# EAGLE design Mirtle_Teensy3_ESP_2016_Hotec6c (EAGLE 7.6.0)
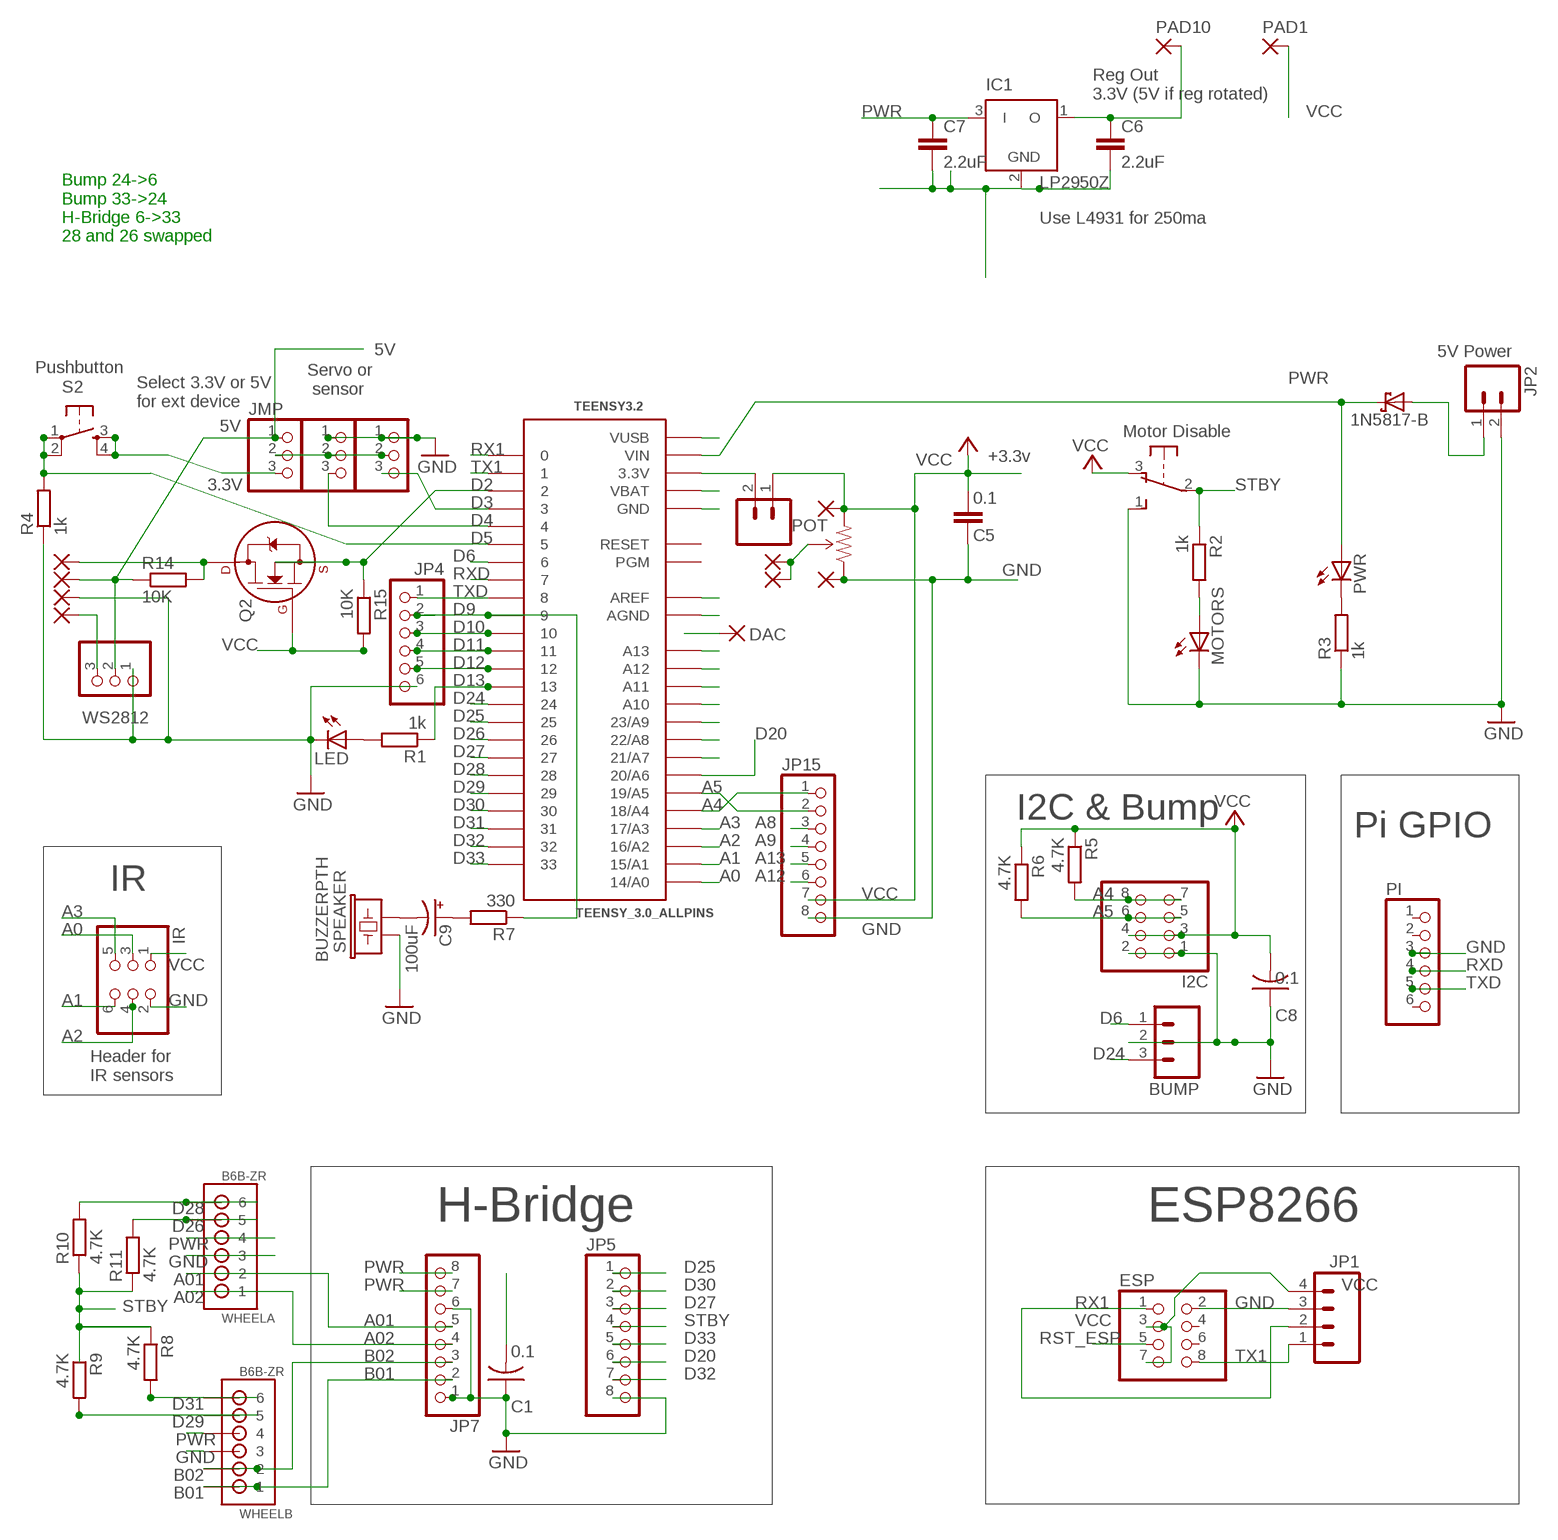
[diagram p0: schematic, sheet 1]

## Parts
3V3  M02PTH  [1X02]
BUMP  M03SCREW  [SCREWTERMINAL-3.5MM-3]
C1  0.1  C-US025-024X044  [C025-024X044]
C5  0.1  CAPEZ  [CAP-PTH-SMALLEZ]
C6  2.2uF  C-EU050-024X044  [C050-024X044]
C7  2.2uF  C-EU050-024X044  [C050-024X044]
C8  0.1  C-US025-024X044  [C025-024X044]
C9  100uF  CPOL-USE2.5-5  [E2,5-5]
D1  1N5817-B  [DO41-7.6]
DAC  1,6/0,8  [1,6/0,8]
ESP  PINHD-2X4  [2X04]
EXT  PINHD-1X3  [1X03]
EXT1  PINHD-1X3  [1X03]
I2C  PINHD-2X4  [2X04]
IC1  LP2950Z  [TO92]
IR  PINHD-2X3  [2X03]
JMP  PINHD-1X3  [1X03]
JP1  M04PTH  [1X04]
JP2  M023.5MM  [SCREWTERMINAL-3.5MM-2]
JP4  PINHD-1X6B  [1X06-BIG]
JP5  PINHD-1X8CLEANBIG  [1X08-CLEANBIG]
JP7  PINHD-1X8CLEANBIG  [1X08-CLEANBIG]
JP15  PINHD-1X8BIG  [1X08-BIG]
LED  LED3MM  [LED3MM]
MOTORS  LED3MM  [LED3MM]
PAD1  1,6/0,8  [1,6/0,8]
PAD2  1,6/0,8  [1,6/0,8]
PAD3  1,6/0,8  [1,6/0,8]
PAD4  1,6/0,8  [1,6/0,8]
PAD5  1,6/0,8  [1,6/0,8]
PAD6  1,6/0,8  [1,6/0,8]
PAD7  1,6/0,8  [1,6/0,8]
PAD8  1,6/0,8  [1,6/0,8]
PAD9  1,6/0,8  [1,6/0,8]
PAD10  1,6/0,8  [1,6/0,8]
PI  PINHD-1X6  [1X06]
POT  TSR-3386  TRIMPOT-PTH-KNOB  [3386U]
PWR  LED3MM  [LED3MM]
Q2  2N7000_TO92  [TO-92]
R1  1k  R-EU_0204/7  [0204/7]
R2  1k  R-EU_0204/7  [0204/7]
R3  1k  R-EU_0204/7  [0204/7]
R4  1k  R-EU_0204/7  [0204/7]
R5  4.7K  R-EU_0204/7  [0204/7]
R6  4.7K  R-EU_0204/7  [0204/7]
R7  330  R-EU_0204/7  [0204/7]
R8  4.7K  R-EU_0204/5  [0204/5]
R9  4.7K  R-EU_0204/5  [0204/5]
R10  4.7K  R-EU_0204/5  [0204/5]
R11  4.7K  R-EU_0204/5  [0204/5]
R14  10K  R-EU_0204/5  [0204/5]
R15  10K  R-EU_0204/5  [0204/5]
S2  TAC_SWITCHPTH  [TACTILE-PTH]
SPEAKER  BUZZERPTH  [BUZZER-12MM]
SW1  OS102011MA1Q  [OS102011MA1Q]
TEENSY3.2  TEENSY_3.0_ALLPINS  [TEENSY_3.0_ALLPINS]
WHEELA  B6B-ZR  [B6B-ZR]
WHEELB  B6B-ZR  [B6B-ZR]
WS2812  PINHD-1X3  [1X03]

## Nets
2N700: PAD2.1(P) Q2.3(D) R14.2
5VIN: C1.2 D1.A JP2.1
A0: IR.3 TEENSY3.2.14/A0
A1: IR.6 TEENSY3.2.15/A1
A01: JP7.5 WHEELA.2
A2: IR.4 TEENSY3.2.16/A2
A02: JP7.4 WHEELA.1
A3: IR.5 TEENSY3.2.17/A3
A4: I2C.7 I2C.8 JP15.1 R5.2 TEENSY3.2.18/A4
A5: I2C.5 I2C.6 JP15.2 R6.2 TEENSY3.2.19/A5
A7: PAD6.1(P) PAD9.1(P) POT.2(WIPER) TEENSY3.2.21/A7
A8: JP15.3 TEENSY3.2.22/A8
A9: JP15.4 TEENSY3.2.23/A9
A10: TEENSY3.2.A10
A11: TEENSY3.2.A11
A12: JP15.6 TEENSY3.2.A12
A13: JP15.5 TEENSY3.2.A13
B01: JP7.2 WHEELB.1
B02: JP7.3 WHEELB.2
D2: Q2.1(S) R15.1 TEENSY3.2.2
D3: EXT.3 TEENSY3.2.3
D4: EXT1.3 TEENSY3.2.4
D5: R4.2 S2.1 S2.2 TEENSY3.2.5
D6: BUMP.1 TEENSY3.2.6
D9: JP4.2 R7.1 TEENSY3.2.9
D10: JP4.3 TEENSY3.2.10
D11: JP4.4 TEENSY3.2.11
D12: JP4.5 TEENSY3.2.12
D13: R1.1 TEENSY3.2.13
D20: JP5.6 TEENSY3.2.20/A6
D24: BUMP.3 TEENSY3.2.24
D25: JP5.1 TEENSY3.2.25
D26: R11.2 TEENSY3.2.26 WHEELA.5
D27: JP5.3 TEENSY3.2.27
D28: R10.2 TEENSY3.2.28 WHEELA.6
D29: R9.2 TEENSY3.2.29 WHEELB.5
D30: JP5.2 TEENSY3.2.30
D31: R8.2 TEENSY3.2.31 WHEELB.6
D32: JP5.7 TEENSY3.2.32
D33: JP5.5 TEENSY3.2.33
GND: BUMP.2 C1.1 C5.1 C6.2 C7.2 C8.1 ESP.2 EXT1.1 EXT.1 I2C.1 I2C.2 IC1.2(GND) IR.2 JP1.3 JP2.2 JP4.6 JP5.8 JP7.1 JP7.6 JP15.8 LED.K(C) MOTORS.K(C) PAD4.1(P) PAD8.1(P) PI.3 POT.1(CCW) R3.1 R4.1 SPEAKER.+ SW1.1(S) TEENSY3.2.AGND TEENSY3.2.GND TEENSY3.2.GND1(GND) TEENSY3.2.GND2(GND) WHEELA.3 WHEELB.3 WS2812.1
N$2: TEENSY3.2.VUSB
N$3: PWR.K(C) R3.2
N$4: LED.A R1.2
N$5: TEENSY3.2.VBAT
N$6: TEENSY3.2.AREF
N$7: 3V3.2 TEENSY3.2.3.3V TEENSY3.2.3.3V1(3.3V) TEENSY3.2.3.3V2(3.3V)
N$8: MOTORS.A R2.2
N$9: C6.1 IC1.1(O) PAD10.1(P)
N$12: PAD5.1(P) WS2812.3
N$13: EXT1.2 EXT.2 JMP.2
N$15: C9.- SPEAKER.-
N$16: C9.+ R7.2
N$51: DAC.1(P)
PWR: C7.1 D1.C IC1.3(I) JMP.1 JP7.7 JP7.8 PAD3.1(P) PWR.A R14.1 TEENSY3.2.VIN WHEELA.4 WHEELB.4 WS2812.2
RST_ESP: ESP.5
RX1: ESP.1 JP1.2 TEENSY3.2.0
RXD: PI.4 TEENSY3.2.7
STBY: JP5.4 R2.1 R8.1 R9.1 R10.1 R11.1 SW1.2(P)
TX1: ESP.8 JP1.1 TEENSY3.2.1
TXD: JP4.1 PI.5 TEENSY3.2.8
VCC: 3V3.1 C5.2 C8.2 ESP.3 ESP.7 I2C.3 I2C.4 IR.1 JMP.3 JP1.4 JP15.7 PAD1.1(P) PAD7.1(P) POT.3(CW) Q2.2(G) R5.1 R6.1 R15.2 S2.3 S2.4 SW1.3(O)
Unconnected: ESP.4 ESP.6 PI.1 PI.2 PI.6 SW1.MT1(MT) SW1.MT2(MT) TEENSY3.2.PGM TEENSY3.2.RESET

## Notes on the sheet
- Reg Out
  3.3V (5V if reg rotated)
- Use L4931 for 250ma
- Bump 24->6
  Bump 33->24
  H-Bridge 6->33
  28 and 26 swapped
- 5V | 5V Power
- Pushbutton
- Servo or
   sensor
- Select 3.3V or 5V
  for ext device
- 5V
- Motor Disable
- +3.3v
- 3.3V
- I2C & Bump
- Pi GPIO
- IR
- Header for
  IR sensors
- H-Bridge | ESP8266

## Library data of the parts
3V3 JP2 = SparkFun-Connectors:M02: Standard 2-pin 0.1" header. Use with - straight break away headers ( PRT-00116) - right angle break away headers (PRT-00553) - swiss pins (PRT-00743) - machine pins (PRT-00117) - female headers (PRT-00115) Molex polarized connector foot print use with: PRT-08233 with associated crimp pins and housings. 2.54_SCREWTERM for use with PRT-10571. 3.5mm Screw Terminal footprints for PRT-08084 5mm Screw Terminal footprints for use with PRT-08433
BUMP = SparkFun-Connectors:M03: Header 3 Standard 3-pin 0.1" header. Use with straight break away headers (SKU : PRT-00116), right angle break away headers (PRT-00553), swiss pins (PRT-00743), machine pins (PRT-00117), and female headers (PRT-00115). Molex polarized connector foot print use with SKU : PRT-08232 with associated crimp pins and housings.
C1 C8 = adafruit_mem:C-US: CAPACITOR, American symbol
C5 = SparkFun-Passives:CAP: Capacitor Standard 0603 ceramic capacitor, and 0.1" leaded capacitor.
C6 C7 = rcl:C-EU: CAPACITOR, European symbol
C9 = adafruit:CPOL-US: POLARIZED CAPACITOR, American symbol
D1 = diode:1N581*: 1.0A SCHOTTKY BARRIER RECTIFIER Source: http://www.diodes.com/datasheets/ds23001.pdf
DAC PAD1-PAD10 = wirepad:1,6/0,8: THROUGH-HOLE PAD
ESP = adafruit_mem:PINHD-2X4: PIN HEADER
EXT EXT1 JMP WS2812 = adafruit:PINHD-1X3: PIN HEADER
I2C = adafruit:PINHD-2X4: PIN HEADER
IC1 = linear:LP2950: 100 mA, Low Power Low Dropout Voltage Regulator Source: http://www.onsemi.com/pub/Collateral/LP2950-D.PDF
IR = pinhead:PINHD-2X3: PIN HEADER
JP1 = SparkFun-Connectors:M04: Header 4 Standard 4-pin 0.1" header. Use with straight break away headers (SKU : PRT-00116), right angle break away headers (PRT-00553), swiss pins (PRT-00743), machine pins (PRT-00117), and female headers (PRT-00115). Molex polarized connector foot print use with SKU : PRT-08231 with associated crimp pins and housings. 1MM SMD Version SKU: PRT-10208
JP4 PI = adafruit:PINHD-1X6: PIN HEADER
JP5 JP7 JP15 = adafruit:PINHD-1X8: PIN HEADER
LED MOTORS PWR = led:LED: LED OSRAM: - CHIPLED LG R971, LG N971, LY N971, LG Q971, LY Q971, LO R971, LY R971 LH N974, LH R974 LS Q976, LO Q976, LY Q976 LO Q996 - Hyper CHIPLED LW Q18S LB Q993, LB Q99A, LB R99A - SideLED LS A670, LO A670, LY A670, LG A670, LP A670 LB A673, LV A673, LT A673, LW A673 LH A674 LY A675 LS A676, LA A676, LO A676, LY A676, LW A676 LS A679, LY A679, LG A679 - Hyper Micro SIDELED® LS Y876, LA Y876, LO Y876, LY Y876 LT Y87S - SmartLED LW L88C, LW L88S LB L89C, LB L89S, LG L890 LS L89K, LO L89K, LY L89K LS L896, LA L896, LO L896, LY L896 - TOPLED LS T670, LO T670, LY T670, LG T670, LP T670 LSG T670, LSP T670, LSY T670, LOP T670, LYG T670 LG T671, LOG T671, LSG T671 LB T673, LV T673, LT T673, LW T673 LH T674 LS T676, LA T676, LO T676, LY T676, LB T676, LH T676, LSB T676, LW T676 LB T67C, LV T67C, LT T67C, LS T67K, LO T67K, LY T67K, LW E67C LS E67B, LA E67B, LO E67B, LY E67B, LB E67C, LV E67C, LT E67C LW T67C LS T679, LY T679, LG T679 LS T770, LO T770, LY T770, LG T770, LP T770 LB T773, LV T773, LT T773, LW T773 LH T774 LS E675, LA E675, LY E675, LS T675 LS T776, LA T776, LO T776, LY T776, LB T776 LHGB T686 LT T68C, LB T68C - Hyper Mini TOPLED® LB M676 - Mini TOPLED Santana® LG M470 LS M47K, LO M47K, LY M47K Source: http://www.osram.convergy.de LUXEON: - LUMILED® LXK2-PW12-R00, LXK2-PW12-S00, LXK2-PW14-U00, LXK2-PW14-V00 LXK2-PM12-R00, LXK2-PM12-S00, LXK2-PM14-U00 LXK2-PE12-Q00, LXK2-PE12-R00, LXK2-PE12-S00, LXK2-PE14-T00, LXK2-PE14-U00 LXK2-PB12-K00, LXK2-PB12-L00, LXK2-PB12-M00, LXK2-PB14-N00, LXK2-PB14-P00, LXK2-PB14-Q00 LXK2-PR12-L00, LXK2-PR12-M00, LXK2-PR14-Q00, LXK2-PR14-R00 LXK2-PD12-Q00, LXK2-PD12-R00, LXK2-PD12-S00 LXK2-PH12-R00, LXK2-PH12-S00 LXK2-PL12-P00, LXK2-PL12-Q00, LXK2-PL12-R00 Source: www.luxeon.com KINGBRIGHT: KA-3528ASYC Source: www.kingbright.com
POT = SparkFun-Electromechanical:TRIMPOT: Various small potentiometers for "set-and-forget" applications; PROD_ID: RES-09730
Q2 = transistors:2N700*: 2N7000, 2N7002, NDS7002A N-channel enhancement mode MOSFET
R1-R11 R14 R15 = resistor:R-EU_: RESISTOR, European symbol
S2 = SparkFun-Electromechanical:TAC_SWITCH: Momentary Switch Button commonly used for reset or general input. Spark Fun Electronics SKU : COM-00097 SMT- SWCH-08247
SPEAKER = SparkFun-Electromechanical:BUZZER: Buzzer 12mm Spark Fun Electronics SKU : Comp-Buzzer
SW1 = adafruit_mem:OS102011MA1Q: OS10201MA1Q through-hole right angle switch http://www.ladyada.net/library/eagle
TEENSY3.2 = Teensy3.0:TEENSY_3.0_ALLPINS: Teensy 3.0 with all pin holes and optional SMD-mount unshrouded header on bottom of Teensy 3.0. For more basic versions, see 'Basic', '+4' and 'AllAnalogPins'. Requires the installation of a un-shrouded SMD header on the underside of the Teensy 3.0
WHEELA WHEELB = jst:B6B-ZR: JST-ZH Connector 6 pol, 1.5mm pitch Package: B6B-ZR Source: http://www.jst-mfg.com/product/pdf/eng/eZH.pdf

## Net classes
1 power: width 0.305 mm, clearance 0.305 mm

## Board
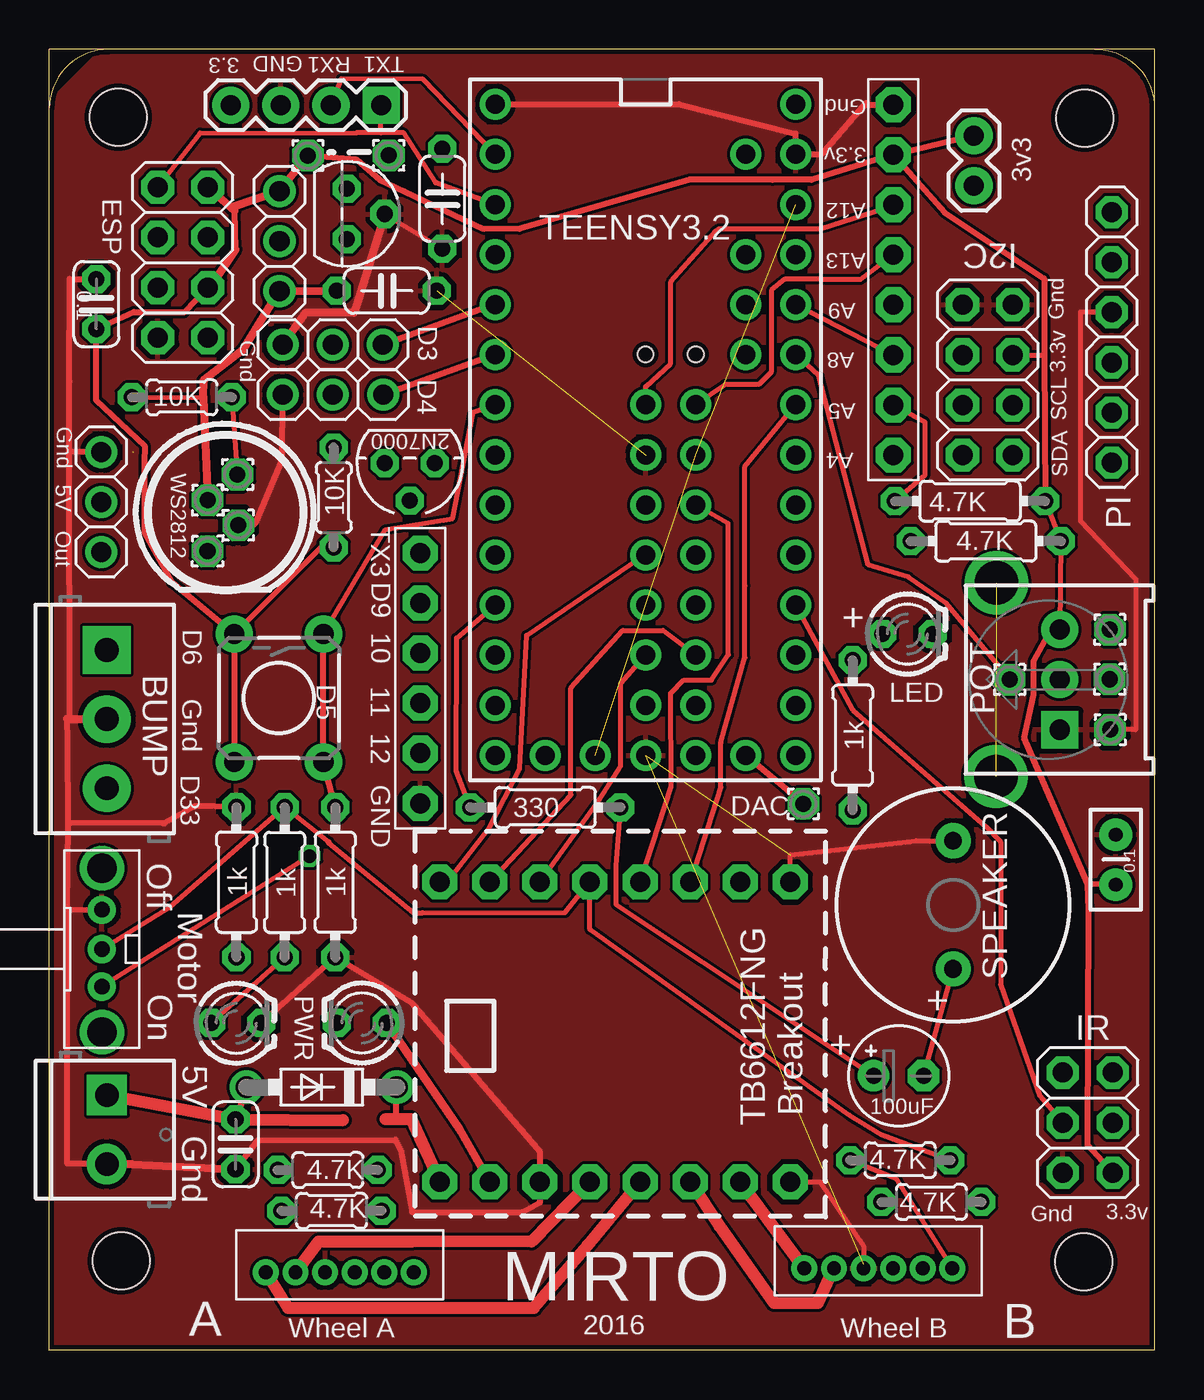
[diagram p1: board, top side]
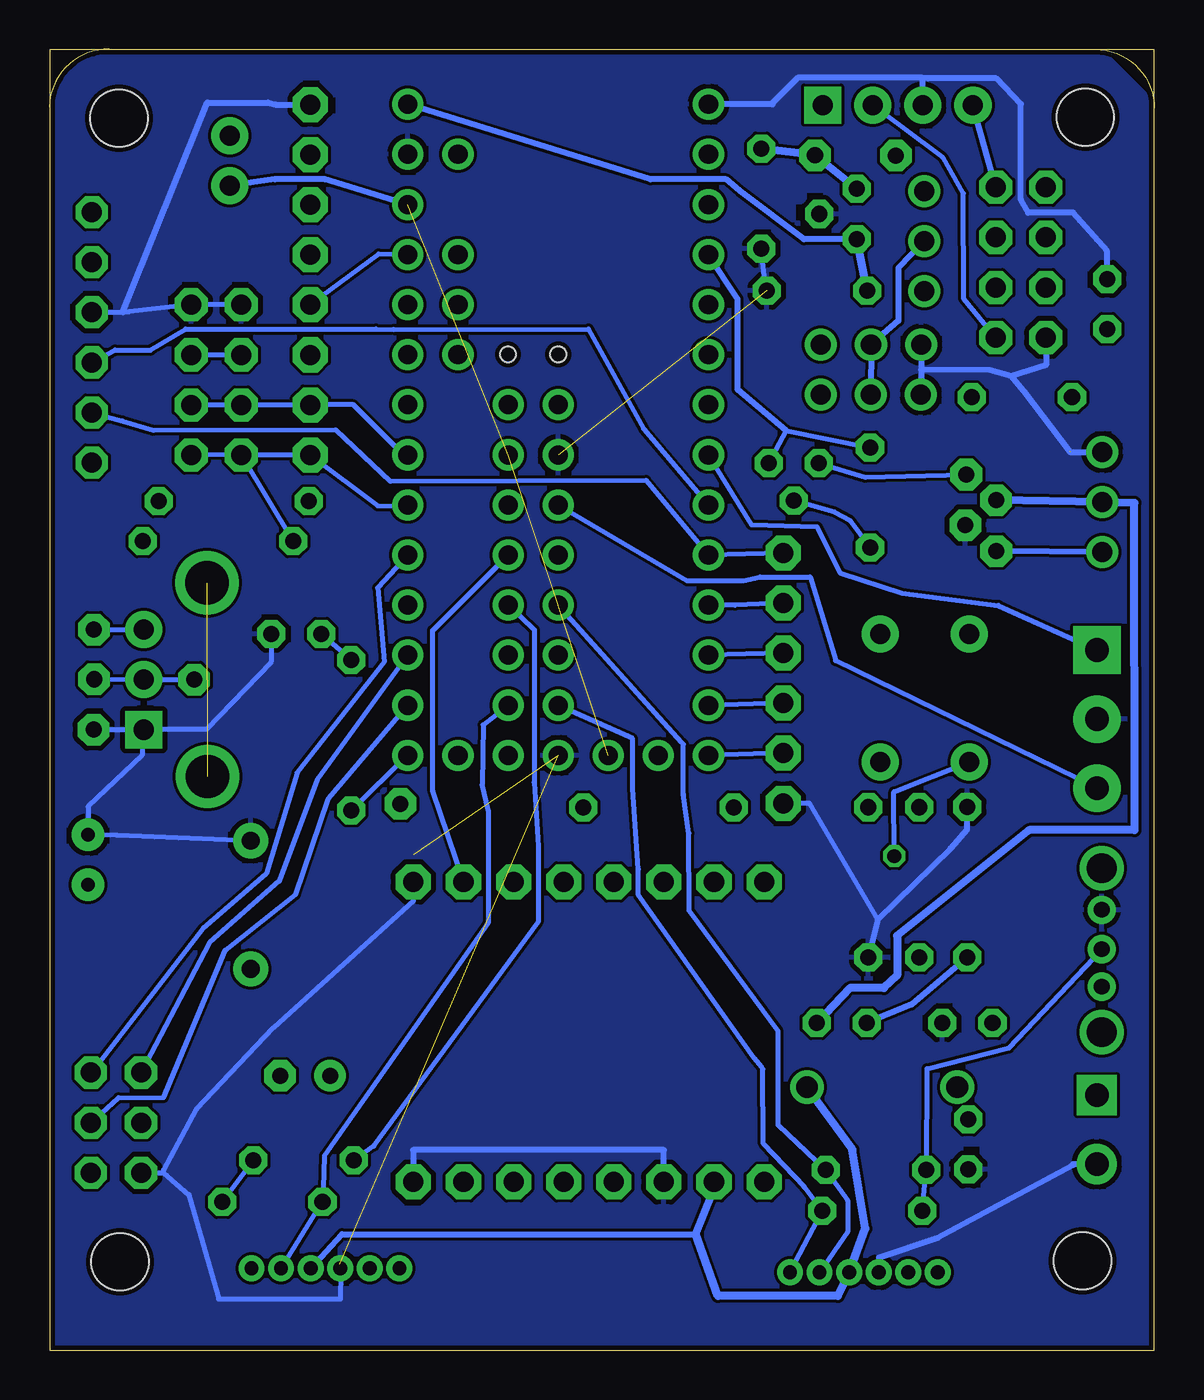
[diagram p2: board, bottom side, seen from below]

Size 56.03 x 65.98 mm. Coordinates in mm from the lower left corner, seen from the top.
Outline: 53,65.98 56.02,65.98 56.01,0 0,0 0,62.98
Outline: 53,65.98 3,65.98
Outline: 3,65.98 0,65.98 0,62.98
Outline: 3,65.98 arc90 0,62.98
Outline: 53,65.98 arc-90 56.03,63.04
Copper layers (1*16): Top 0.035mm / dielectric 1.5mm / Bottom 0.035mm
Design rules "DFRobot_Eagle_Rule_v0.4": minimum track width 6mil, minimum drill 12mil, track to track 6mil, track to pad 6mil, pad to pad 6mil, via to via 6mil, smd to smd 0mil, copper to edge 10mil, drill to drill 10mil, minimum pad ring 12mil, minimum via ring 8mil, stop-mask expansion 2mil, vias tented up to drill 25mil, thermal gap 10mil
Holes 2.9 mm at 52.5,62.48 3.65,4.53 3.5,62.53 52.45,4.48
Holes 0.8 mm at 30.23,50.51 32.77,50.51
tRestrict: area 13.6,3.1 to 14.4,3.9; area 2.5,9.9 to 3.3,10.7; area 2.5,8.2 to 3.3,9; area 8.8,8.2 to 9.7,9; area 9.5,8.9 to 10.3,9.7; area 23.7,8.1 to 24.5,8.9; area 25.2,8.1 to 26,8.9; area 37.1,8.9 to 37.9,9.7; area 36.4,8.1 to 37.2,8.9; area 37.2,7.4 to 38,8.2; area 40.9,3.2 to 41.7,4; area 51,7.9 to 51.8,8.7; 79 more areas
bRestrict: area 13.6,3.1 to 14.4,3.9; area 8.9,9.5 to 9.7,10.3; area 10.8,50.6 to 11.6,51.4; area 12.1,50.6 to 12.8,51.4; area 11.4,51.2 to 12.2,52; area 10.8,48 to 11.6,48.8; area 11.3,47.5 to 12.2,48.3; area 12.1,48 to 12.9,48.8; area 5.8,50.9 to 6.6,51.7; area 4.4,51 to 5.2,51.8; area 5.1,51.6 to 5.9,52.5; area 2,53.4 to 2.8,54.2; 84 more areas

### Footprints (pad centres in the part's own frame; a part is rotated, then mirrored left to right if it is on the bottom)
1X02 = drill 1.016 pad 1.88: 1 0,0; 2 2.54,0
SCREWTERMINAL-3.5MM-3 = drill 1.2 pad 2.413 square: 1 0,0 | drill 1.2 pad 2.413: 2 3.5,0; 3 7,0
C025-024X044 = drill 0.813 pad 1.422 octagon: 1 -1.27,0; 2 1.27,0
CAP-PTH-SMALLEZ = drill 0.7 pad 1.651: 1 0,0; 2 2.54,0
C050-024X044 = drill 0.813 octagon: 1 -2.54,0; 2 2.54,0
E2,5-5 = drill 0.813 pad 1.6: + -1.27,0 | drill 0.813 pad 1.6 octagon: - 1.27,0
DO41-7.6 = drill 1.1 pad 1.7: A 3.81,0; C -3.81,0
1,6/0,8 = drill 0.813 pad 1.6 octagon: 1 0,0
2X04 = drill 1.016 pad 1.676 octagon: 1 -3.81,-1.27; 2 -3.81,1.27; 3 -1.27,-1.27; 4 -1.27,1.27; 5 1.27,-1.27; 6 1.27,1.27; 7 3.81,-1.27; 8 3.81,1.27
1X03 = drill 1.016: 1 -2.54,0; 2 0,0; 3 2.54,0
TO92 = drill 0.813 octagon: 1 -1.27,0; 2 0,1.905; 3 1.27,0
2X03 = drill 1.016 octagon: 1 -2.54,-1.27; 2 -2.54,1.27; 3 0,-1.27; 4 0,1.27; 5 2.54,-1.27; 6 2.54,1.27
1X04 = drill 1.016 pad 1.88 square: 1 0,0 | drill 1.016 pad 1.88: 2 2.54,0; 3 5.08,0; 4 7.62,0
SCREWTERMINAL-3.5MM-2 = drill 1.2 pad 2.032 square: 1 0,0 | drill 1.2 pad 2.032: 2 3.5,0
1X06-BIG = drill 1.016 pad 1.778 octagon: 1 -6.35,0; 2 -3.81,0; 3 -1.27,0; 4 1.27,0; 5 3.81,0; 6 6.35,0
1X08-CLEANBIG = drill 1.016 pad 1.778 octagon: 1 -8.89,0; 2 -6.35,0; 3 -3.81,0; 4 -1.27,0; 5 1.27,0; 6 3.81,0; 7 6.35,0; 8 8.89,0
1X08-BIG = drill 1.016 pad 1.778 octagon: 1 -8.89,0; 2 -6.35,0; 3 -3.81,0; 4 -1.27,0; 5 1.27,0; 6 3.81,0; 7 6.35,0; 8 8.89,0
LED3MM = drill 0.813 octagon: A -1.27,0; K 1.27,0
1X06 = drill 1.016 octagon: 1 -6.35,0; 2 -3.81,0; 3 -1.27,0; 4 1.27,0; 5 3.81,0; 6 6.35,0
3386U = drill 1.016 pad 1.88 square: 1 -2.54,-0.015 | drill 1.016 pad 1.88: 2 0,-0.015; 3 2.54,-0.015
TO-92 = drill 0.813 octagon: 1 -1.27,0; 2 0,1.905; 3 1.27,0
0204/7 = drill 0.813 octagon: 1 -3.81,0; 2 3.81,0
0204/5 = drill 0.813 octagon: 1 -2.54,0; 2 2.54,0
TACTILE-PTH = drill 1.016 pad 1.88: 1 -3.251,2.261; 2 3.251,2.261; 3 -3.251,-2.261; 4 3.251,-2.261
BUZZER-12MM = drill 0.9 pad 1.778: + 3.25,0; - -3.25,0
OS102011MA1Q = drill 0.8 pad 1.422: 1 -2,0; 2 0,0; 3 1.9,0 | drill 1.5 pad 2.184: MT1 -4.1,0; MT2 4.2,0
TEENSY_3.0_ALLPINS = drill 0.965: 0 -7.62,13.97; 1 -7.62,11.43; 2 -7.62,8.89; 3 -7.62,6.35; 3.3V 7.62,11.43; 3.3V1 -2.54,-16.51; 3.3V2 2.54,-1.27; 4 -7.62,3.81; 5 -7.62,1.27; 6 -7.62,-1.27; 7 -7.62,-3.81; 8 -7.62,-6.35; 9 -7.62,-8.89; 10 -7.62,-11.43; 11 -7.62,-13.97; 12 -7.62,-16.51; 13 7.62,-16.51; 14/A0 7.62,-13.97; 15/A1 7.62,-11.43; 16/A2 7.62,-8.89; 17/A3 7.62,-6.35; 18/A4 7.62,-3.81; 19/A5 7.62,-1.27; 20/A6 7.62,1.27; 21/A7 7.62,3.81; 22/A8 7.62,6.35; 23/A9 7.62,8.89; 24 0,-3.81; 25 0,-6.35; 26 0,-8.89; 27 0,-11.43; 28 0,-13.97; 29 2.54,-13.97; 30 2.54,-11.43; 31 2.54,-8.89; 32 2.54,-6.35; 33 2.54,-3.81; A10 5.08,6.35; A11 5.08,3.81; A12 0,1.27; A13 2.54,1.27; AGND 7.62,13.97; AREF 5.08,8.89; GND -7.62,16.51; GND1 0,-16.51; GND2 0,-1.27; PGM 2.54,-16.51; RESET 5.08,-16.51; VBAT -5.08,-16.51; VIN 7.62,16.51; VUSB 5.08,13.97
B6B-ZR = drill 0.7: 1 9,-1.3; 2 7.5,-1.3; 3 6,-1.3; 4 4.5,-1.3; 5 3,-1.3; 6 1.5,-1.3

### Placement (x,y rotation side)
3V3  46.88,61.6 270 top
BUMP  2.91,35.51 270 top
C1  9.44,10.44 90 top
C5  54.07,26.15 270 top
C6  19.93,58.4 270 top
C7  17.11,53.73 0 top
C8  2.39,53.06 270 top
C9  43.06,13.92 0 top
D1  13.81,13.34 180 top
DAC  38.23,27.71 0 top
ESP  6.77,55.17 90 top
EXT  14.37,51.01 0 top
EXT1  14.38,48.46 0 top
I2C  47.57,49.21 270 top
IC1  15.09,57.63 270 top
IR  52.65,11.54 90 top
JMP  11.67,56.25 90 top
JP1  16.82,63.15 180 top
JP2  2.92,12.94 270 top
JP4  18.81,34.09 270 top
JP5  28.68,23.75 0 top
JP7  28.68,8.53 180 top
JP15  42.79,54.29 90 top
LED  43.51,36.33 0 top
MOTORS  9.48,16.59 0 top
PAD1  13.11,60.59 0 top
PAD2  9.54,44.41 0 top
PAD3  8.03,43.11 0 top
PAD4  9.59,41.84 0 top
PAD5  8.02,40.53 0 top
PAD6  48.69,34.01 0 top
PAD7  53.77,36.55 0 top
PAD8  53.78,31.47 0 top
PAD9  53.76,34.03 0 top
PAD10  17.21,60.6 180 top
PI  53.87,51.37 270 top
POT  51.22,34.01 90 top
PWR  15.85,16.59 180 top
Q2  18.28,44.99 180 top
R1  40.73,31.19 90 top
R2  11.93,23.73 270 top
R3  9.49,23.74 270 top
R4  14.5,23.73 90 top
R5  47.48,41.03 180 top
R6  46.68,43.06 180 top
R7  25.14,27.53 0 top
R8  43.14,9.64 180 top
R9  44.72,7.52 180 top
R10  14.31,7.07 0 top
R11  14.12,9.14 0 top
R14  6.72,48.33 0 top
R15  14.42,43.25 270 top
S2  11.64,33.08 270 top
SPEAKER  45.82,22.59 90 top
SW1  2.67,20.34 270 top
TEENSY3.2  30.23,46.68 0 top
WHEELA  19.98,2.65 180 top
WHEELB  47.28,2.86 180 top
WS2812  2.64,43.02 270 top

### Tracks (layer width: path | path; a pad name or v marks a point on that pad's centre or on a via)
2N700
  Top 0.254: R14.2 PAD2.1
  Bottom 0.254: Q2.3 14.65,44.28 PAD2.1
5VIN
  Top 0.305: D1.A C1.2
  Top 0.61: JP2.1 C1.2 14.89,11.67
A0
  Bottom 0.254: IR.3 52.53,12.81 50.23,12.82 47.12,20.28 43.54,23.11 41.88,27.97 TEENSY3.2.14/A0
A1
  Bottom 0.254: TEENSY3.2.15/A1 42.44,28.94 44.37,23.8 47.89,20.69 IR.6
A01
  Top 0.61: JP7.5 24.45,5.52 18.4,5.51 13.64,5.5 WHEELA.2
A2
  Top 0.254: TEENSY3.2.16/A2 40.74,32.48 47.48,26.56 48.23,25.77 48.23,18.53 50.22,12.89 IR.4
A02
  Top 0.61: JP7.4 27.29,5.33 24.57,2.14 12.1,2.15 WHEELA.1
A3
  Bottom 0.254: TEENSY3.2.17/A3 39.38,38.67 39.06,34.9 43.46,29.29 45.04,24.16 48.26,21.36 53.89,14.1 IR.5
A4
  Bottom 0.254: R5.2 46.2,45.25 46.37,45.42 | TEENSY3.2.18/A4 37.91,42.81 39.39,42.83 JP15.1 I2C.7 46.37,45.42 | 46.37,45.42 I2C.8
A5
  Top 0.254: R6.2 44.4,44.41 44.4,47.07 JP15.2
  Bottom 0.254: TEENSY3.2.19/A5 38.07,45.41 40.61,47.95 JP15.2 I2C.5 I2C.6
A7
  Top 0.254: TEENSY3.2.21/A7 39.02,49.43 41.53,39.83 43.56,39.22 45.43,37.91 PAD6.1
  Bottom 0.254: PAD9.1 POT.2 PAD6.1
A8
  Top 0.254: TEENSY3.2.22/A8 JP15.3
A9
  Bottom 0.254: TEENSY3.2.23/A9 39.33,55.6 JP15.4
A12
  Top 0.254: TEENSY3.2.A12 30.23,48.88 31.5,50.05 31.52,54.18 33.81,56.79 33.95,56.87 39.11,56.87 42.37,57.93 JP15.6
A13
  Top 0.254: TEENSY3.2.A13 34.26,48.98 35.96,48.98 36.6,49.6 36.61,53.76 37.28,54.31 39.17,54.31 41.14,54.31 JP15.5
B01
  Top 0.61: WHEELB.1 JP7.2
B02
  Top 0.61: JP7.3 33.98,6.28 36.73,2.4 38.98,2.4 WHEELB.2
D2
  Bottom 0.254: Q2.1 18.67,46.64 R15.1
  Bottom 0.305: 18.67,46.64 21.13,48.73 21.13,53.31 TEENSY3.2.2
D3
  Top 0.305: EXT.3 22.61,53.07 TEENSY3.2.3
D4
  Top 0.305: EXT1.3 22.61,50.52 TEENSY3.2.4
D5
  Top 0.254: S2.1 17.04,41.61 20.45,42.18 21.49,47.57 TEENSY3.2.5
  Top 0.305: S2.1 S2.2 R4.2
D6
  Bottom 0.254: TEENSY3.2.6 20.44,41.87 17.11,41.77 15.92,39.41 12.8,38.4 7.91,37.77 BUMP.1
D9
  Top 0.254: R7.1 20.63,29.37 20.65,36.13 TEENSY3.2.9
  Bottom 0.254: JP4.2 21.26,37.79 TEENSY3.2.9
D10
  Bottom 0.254: JP4.3 TEENSY3.2.10
D11
  Bottom 0.254: JP4.4 TEENSY3.2.11
D12
  Bottom 0.254: JP4.5 TEENSY3.2.12
D13
  Bottom 0.254: TEENSY3.2.13 R1.1
D20
  Top 0.254: TEENSY3.2.20/A6 35.27,44.82 35.26,38.78 35.27,35.13 34.05,30.82 34.05,28.56 JP5.6
D24
  Bottom 0.254: BUMP.3 16.17,34.98 17.46,39.22 20,39.22 20.83,39.03 23.7,39.03 TEENSY3.2.24
D25
  Top 0.254: TEENSY3.2.25 29.91,40.14 24.2,36.26 23.85,29.5 22.29,26.46 20.42,24.07 JP5.1
D26
  Bottom 0.254: TEENSY3.2.26 23.96,30.82 23.88,30.73 23.88,28.2 23.61,26.21 23.59,22.28 19.07,16.18 19.07,11.42 R11.2 15.55,7.6 15.55,6 WHEELA.5
D27
  Top 0.254: TEENSY3.2.27 28.96,33.81 28.96,29.62 27.91,27.96 JP5.3
D28
  Bottom 0.254: TEENSY3.2.28 26.46,31.02 26.45,28.49 26.16,24.39 26.16,23.09 20.3,14.81 19.93,14.37 19.85,14.26 19.83,10.47 17.76,8.28 R10.2 WHEELA.6
D29
  Bottom 0.254: TEENSY3.2.29 34.04,31.72 34.08,28.69 33.78,27.39 33.78,21.68 42.09,9.86 42.17,7.4 R9.2 WHEELB.5
D30
  Top 0.254: TEENSY3.2.30 31.12,36.51 29.08,36.51 26.44,33.58 26.44,28.17 JP5.2
D31
  Top 0.254: WHEELB.6 42.93,8.69 R8.2
  Bottom 0.254: TEENSY3.2.31 31.44,36.53 31.45,28.8 31.24,25.54 31.25,21.72 39.58,10.36 R8.2
D32
  Bottom 0.254: JP5.7 36.58,28.36 36.6,36.51 TEENSY3.2.32
D33
  Top 0.254: JP5.5 31.52,28.58 31.5,33.31 32.17,33.98 33.57,33.98 34.43,35.28 34.41,41.93 TEENSY3.2.33
GND  (4 unrouted)
  Top 0.254: 37.87,60.67 TEENSY3.2.AGND | JP7.1 39.09,8.53 39.09,8.52 41.28,5.28 WHEELB.3 | JP5.8 37.57,25.13 43.93,25.84 SPEAKER.+ | IC1.2 C6.2 | PI.3 52.28,52.66 52.28,42.06 55.09,39.09 55.08,31.47 PAD8.1
  Top 0.305: JP2.2 0.91,9.46 0.91,22.37 | 0.91,22.37 0.96,26.75 | 0.96,26.75 0.93,30.9 0.9,32.02 | BUMP.2 1.03,32.02 1,45.57 | 1,45.57 1.02,49.13 1.03,54.33 C8.1 | R3.1 7.36,27.6 7.36,27.57 5.81,26.71 0.96,26.75 | WS2812.1 1,45.57 | 0.91,22.37 SW1.1 | TEENSY3.2.GND 31.92,63.2 37.82,61.71 37.82,60.65 TEENSY3.2.AGND | 17.81,10.14 18.4,7 23.97,7 24.88,7.49 JP7.6 | 37.87,60.67 39.18,60.67 39.18,60.68 41.4,63.25 41.4,63.18 JP15.8 | PAD4.1 10.33,41.84 10.48,41.99 11.82,45.14 EXT1.1 | MOTORS.K R4.1 18.4,17.6 24.88,10.06 JP7.6 | JP7.6 | C1.1 10.57,10.65 17.56,10.67 17.86,10.03
  Top 0.406: 0.9,32.02 BUMP.2 | IC1.2 15.46,52.62 12.99,52.62 EXT.1 | JP2.2 4.18,9.44 4.18,9.43 C1.1
  Bottom 0.254: PAD8.1 POT.1 | PI.3 52.3,52.64 51.98,52.67 | POT.1 51.33,31.47 51.33,30.17 54.06,27.57 C5.1 52.59,26.12 SPEAKER.+ | IR.2 50.23,9 | 50.23,9 50.23,9.16 48.57,12.21 44.65,16.38 37.56,22.8 JP5.8 | I2C.1 I2C.2 51.98,52.67 | 14.04,21.86 17.46,27.68 17.5,27.74 JP4.6 | 51.98,52.67 52.33,52.63 | C7.2 19.7,53.79 C6.2 | LED.K 44.78,34.91 48.08,31.49 POT.1 | 50.23,9 48.96,7.89 47.44,2.6 41.26,2.6 41.24,3.96 41.33,4.12 41.3,4.35
  Bottom 0.305: EXT.1 11.83,49.72 | 11.83,49.72 EXT1.1 | ESP.2 5.49,49.97 7.27,49.41 | 7.27,49.41 6.63,48.65 4.29,45.57 | JP7.6 24.87,10.15 37.59,10.15 JP7.1 | R3.1 9.51,26.39 10.33,25.46 14.04,21.86 R4.1 | 52.3,52.64 48.02,63.28 44.94,63.28 44.55,63.18 42.73,63.18 42.75,63.21 JP15.8 | 7.27,49.41 8.36,49.71 11.83,49.72 | WHEELA.3 13.96,4.7 11,5.69 4.12,9.4 4.12,9.44 JP2.2 | JP1.3 11.74,64.53 | 11.74,64.53 18.09,64.53 19.36,63.26 19.36,63.19 TEENSY3.2.GND | C8.1 2.4,55.74 4.14,57.7 6.41,57.69 6.77,58.36 6.77,63.2 8.03,64.51 11.47,64.51 11.74,64.53 | 4.25,45.54 WS2812.1
  pour Top: 0,0 0,63.21 2.54,65.75 54.61,65.75 55.88,64.48 55.88,0
  pour Bottom: 0,0 0,63.21 2.54,65.75 54.61,65.75 55.88,64.48 55.88,0
N$3
  Bottom 0.305: R3.2 12.31,17.53 PWR.K
N$4
  Bottom 0.254: R1.2 LED.A
N$7  (2 unrouted)
  Bottom 0.305: TEENSY3.2.3.3V 42.06,59.39 44.59,59.39 3V3.2
N$8
  Top 0.254: R2.2 MOTORS.A
N$9
  Bottom 0.406: C6.1 PAD10.1 IC1.1
N$12
  Bottom 0.305: WS2812.3 PAD5.1
N$13
  Bottom 0.305: EXT.2 14.35,51.02 | 14.35,51.02 EXT1.2 | JMP.2 12.98,54.88 12.98,52.21 14.35,51.02
N$15
  Top 0.254: C9.- SPEAKER.-
N$16
  Top 0.254: R7.2 28.72,24.55 28.72,22.62 C9.+
N$51
  Top 0.305: DAC.1 37.22,28.58 35.28,30.18
N$99  (via drill 2.2)  (1 unrouted)
  other vias: 48.03,38.92 48,29.1
PWR
  Top 0.254: R14.1 7.81,48.33
  Top 0.305: D1.C 17.54,11.71
  Top 0.406: C7.1 JMP.1 9.84,50.74 7.82,49.2 7.81,48.33 PAD3.1 | JP7.7 20.8,11.2 PWR.A
  Top 0.61: JP7.8 18.34,11.71 17.54,11.71 17.04,11.71
  Bottom 0.305: WHEELB.4 41.2,5.89 23.25,5.89 | TEENSY3.2.VIN 25.55,59.39 21.72,59.39 21.03,58.81 17.76,56.35 IC1.3 | 22.4,8.46 JP7.7
  Bottom 0.406: PWR.A 15.44,18.37 13.71,18.37 13.05,19 13.04,21.03 6.35,26.38 1.01,26.38 1.01,42.97 WS2812.2 PAD3.1 | C7.1 IC1.3 | 22.4,8.46 22.4,8 23.25,5.89 22.13,2.76 16.05,2.76 WHEELA.4 14.65,6.18 15.32,10.18 D1.C
RX1
  Top 0.254: TEENSY3.2.0 18.96,64.46 14.8,64.48 JP1.2
  Bottom 0.254: ESP.1 9.68,53.34 9.69,58.67 10.71,60.47 12.71,61.98 JP1.2
RXD
  Bottom 0.254: PI.4 52.69,50.73 50.91,50.72 49.12,51.79 39.46,51.79 38.57,51.77 28.7,51.79 25.9,46.72 TEENSY3.2.7
STBY
  Top 0.254: SW1.2 6.11,22.45 R2.1 14.18,25.79 14.14,25.76 18.47,22.19 18.93,22.19 26.15,22.2 JP5.4 27.41,21.34 40.56,11.92 42.17,10.93 R8.1
  Bottom 0.254: R10.1 R11.1 11.54,14.28 7.38,15.33 SW1.2 | R8.1 R9.1
TX1
  Top 0.254: ESP.8 7.65,61.73 15.57,61.74 16.81,61.75 | TEENSY3.2.1 19.59,59.21 17.96,61.74 16.81,61.75 | 16.81,61.75 JP1.1
TXD
  Bottom 0.254: JP4.1 TEENSY3.2.8 25.78,44.13 38.74,44.07 41.51,46.69 50.75,46.66 52.31,47.13 PI.5
VCC  (via drill 0.7)
  Top 0.254: SW1.3 v13.19,25.06 | R6.1 R5.1 POT.3 | I2C.4 50.44,50.48 | R15.2 13.76,40.71 S2.3
  Top 0.305: 8.4,54.27 ESP.3 6.84,52.64 4.29,52.65 C8.2 2.37,48.19 4.86,45.85 4.84,45.01 4.84,41.44 6.23,38.93 S2.3 S2.4 | 9.45,55.83 9.4,57.78 | IR.1 52.64,10.38 52.69,22.3 52.66,23.64 | 52.66,23.64 49.43,31.06 49.9,33.26 49.91,34.95 50.63,36.24 POT.3 | C5.2 52.66,23.64 | R6.1 50.44,50.48 50.44,54.36 45.39,57.7 JP15.7 42.26,60.48 | 42.26,60.48 38.65,59.36 36.66,59.36 32.46,59.37 23.85,56.87 22.03,56.86 18.01,58.76 16.79,59.34 15.59,60.38 PAD1.1 | 3V3.1 42.26,60.48
  Top 0.406: 8.4,54.27 9.45,55.83 | 9.4,57.78 9.21,57.95 | 9.21,57.95 ESP.7 | 9.21,57.95 JMP.3 PAD1.1
  Bottom 0.254: PAD7.1 POT.3 | v13.19,25.06 13.21,28.32 S2.4 | I2C.3 I2C.4 | R15.2 15.41,42.07 16.23,42.51 Q2.2
  Bottom 0.305: ESP.7 JP1.4

### Text on the board
tPlace: TB6612FNG / Breakout
tNames: 3.3 | GND | RX1 | TX1 | Gnd | 3.3v | 3v3 | A12 | A13 | A9 | D3 | Gnd | Gnd | A8 | 3.3v | D4 | A5 | Gnd | SCL | 2N7000 | A4 | 5V | SDA | Out | TX3 | D9 | D6 | 10 | + | D5 | 11 | Gnd | 12 | D33 | GND | Off | Motor | On | + | + | 5V | Gnd | Gnd | 3.3v | MIRTO | A | Wheel A | 2016 | Wheel B | B
Document: Mod for new pinout: / cut trace to pin 4 and connect to pin 2 / cut trace from servo and connect to pin 4 (note wrong labels for servo pins) / connect trace to 20 (A6) - note pin 6 and 20 swapped in code